# EAGLE design untitled (EAGLE 9.3.2)
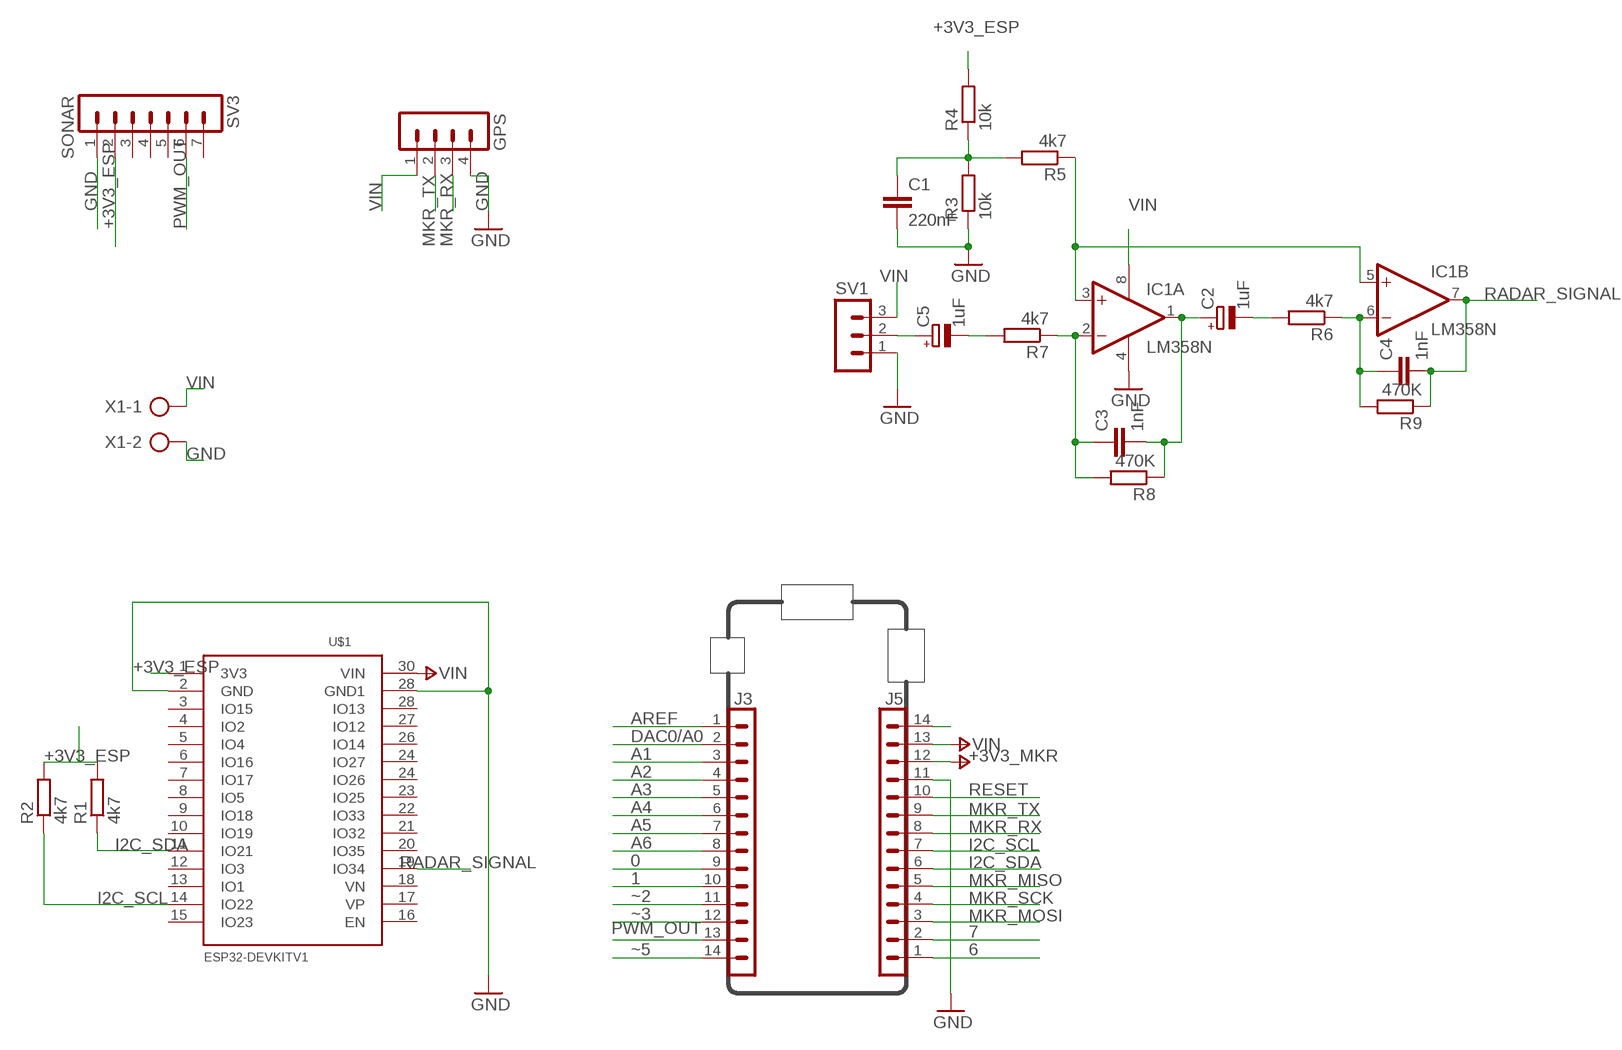
[diagram p0: schematic, sheet 1]

## Parts
C1  220nF  C-EU025-025X050  [C025-025X050]
C2  1uF  CPOL-EUE2-4  [E2-4]
C3  1nF  C-EU025-025X050  [C025-025X050]
C4  1nF  C-EU025-025X050  [C025-025X050]
C5  1uF  CPOL-EUE2-4  [E2-4]
GPS  MA04-1  [MA04-1]
IC1  LM358N  [DIL08]
J3  -  PINHD-1X14-SM-MALE/FEMALETH-SMD  [1X14_SMD_TH]
J5  -  PINHD-1X14-SM-MALE/FEMALETH-SMD  [1X14_SMD_TH]
R1  4k7  R-EU_0207/10  [0207/10]
R2  4k7  R-EU_0207/10  [0207/10]
R3  10k  R-EU_0207/10  [0207/10]
R4  10k  R-EU_0207/10  [0207/10]
R5  4k7  R-EU_0207/10  [0207/10]
R6  4k7  R-EU_0207/10  [0207/10]
R7  4k7  R-EU_0207/10  [0207/10]
R8  470K  R-EU_0207/2V  [0207/2V]
R9  470K  R-EU_0207/2V  [0207/2V]
SV1  MA03-1  [MA03-1]
SV3  SONAR  MA07-1  [MA07-1]
U$1  ESP32DEVKITV1  [ESP32-DEVKITV1]
X1  AK500/2-H  [AK500/2-H]

## Nets
+3V3_ESP: R1.2 R2.2 R4.2 SV3.2 U$1.1(3V3)
+3V3_MKR: J5.12 ; supply symbol labelled +3V3
GND: C1.2 GPS.4 IC1.4(P:V-) J5.11 R3.1 SV1.1 SV3.1 U$1.2(GND) U$1.28(GND1) X1.2
I2C_SCL: J5.7 R2.1 U$1.14(IO22)
I2C_SDA: J5.6 R1.1 U$1.11(IO21)
MKR_MISO: J5.5
MKR_MOSI: J5.3
MKR_RX: GPS.3 J5.8
MKR_SCK: J5.4
MKR_TX: GPS.2 J5.9
N$1: C1.1 R3.2 R4.1 R5.2
N$2: J5.14
N$4: C2.- R6.2
N$5: IC1.3(A:+IN) IC1.5(B:+IN) R5.1
N$6: C4.1 IC1.6(B:-IN) R6.1 R9.2
N$7: C5.- R7.2
N$8: C5.+ SV1.2
N$9: C3.1 IC1.2(A:-IN) R7.1 R8.2
N$10: C2.+ C3.2 IC1.1(A:OUT) R8.1
PA02_AIN0: J3.2
PA03_VREFA: J3.1
PA04_AIN4: J3.5
PA05_AIN5: J3.6
PA06_AIN6: J3.7
PA07_AIN7: J3.8
PA10_TCC0-W2: J3.11
PA11_TCC0-W3: J3.12
PA20_TCC0-W6: J5.1
PA21_TCC0-W7: J5.2
PA22_TC4-W0: J3.9
PA23_TC4-W1: J3.10
PB02_AIN10: J3.3
PB03_AIN11: J3.4
PB11_TCC0-W5: J3.14
PWM_OUT: J3.13 SV3.6
RADAR_SIGNAL: C4.2 IC1.7(B:OUT) R9.1 U$1.19(IO34)
RESET: J5.10
VIN: GPS.1 IC1.8(P:V+) J5.13 SV1.3 U$1.30(VIN) X1.1
Unconnected: SV3.3 SV3.4 SV3.5 SV3.7 U$1.3(IO15) U$1.4(IO2) U$1.5(IO4) U$1.6(IO16) U$1.7(IO17) U$1.8(IO5) U$1.9(IO18) U$1.10(IO19) U$1.12(IO3) U$1.13(IO1) U$1.15(IO23) U$1.16(EN) U$1.17(VP) U$1.18(VN) U$1.20(IO35) U$1.21(IO32) U$1.22(IO33) U$1.23(IO25) U$1.24(IO26) U$1.24(IO27) U$1.26(IO14) U$1.27(IO12) U$1.28(IO13)

## Notes on the sheet
- AREF
- DAC0/A0
- A1
- A2
- A3 | RESET
- A4
- A5
- A6
- 0
- 1
- ~2
- ~3
- 7
- ~5 | 6

## Library data of the parts
C1 C3 C4 = rcl:C-EU: CAPACITOR, European symbol; SPICEPREFIX: C
C2 C5 = rcl:CPOL-EU: POLARIZED CAPACITOR, European symbol; SPICEPREFIX: C
GPS = con-lstb:MA04-1: PIN HEADER; OC_FARNELL: unknown; OC_NEWARK: unknown
IC1 = linear:LM358: OP AMP also LM158; LM258; LM2904 Source: http://cache.national.com/ds/LM/LM158.pdf
J3 J5 = Arduino-connectors:PINHD-1X14-SM: PIN HEADER; DATASHEET: -; DISTRIBUTOR-LINK: -; DISTRIBUTOR-PN: -; MANUFACTURER: ELDECO; MANUFACTURER-PN: FH254114DF08500T
R1-R9 = rcl:R-EU_: RESISTOR, European symbol; SPICEPREFIX: R
SV1 = con-lstb:MA03-1: PIN HEADER; OC_FARNELL: unknown; OC_NEWARK: unknown
SV3 = con-lstb:MA07-1: PIN HEADER; OC_FARNELL: unknown; OC_NEWARK: unknown
U$1 = ESP32-DEVKITV1:ESP32DEVKITV1
X1 = con-ptr500:AK500/2-H: CONNECTOR Aug. 2004 / PTR Meßtechnik: Die Bezeichnung der Serie AK505 wurde geändert. Es handelt sich hierbei um AK500 in horizontaler Ausführung.; OC_FARNELL: unknown; OC_NEWARK: unknown

## Net classes
0 default: width 0.19 mm, drill 0.19 mm

## Board
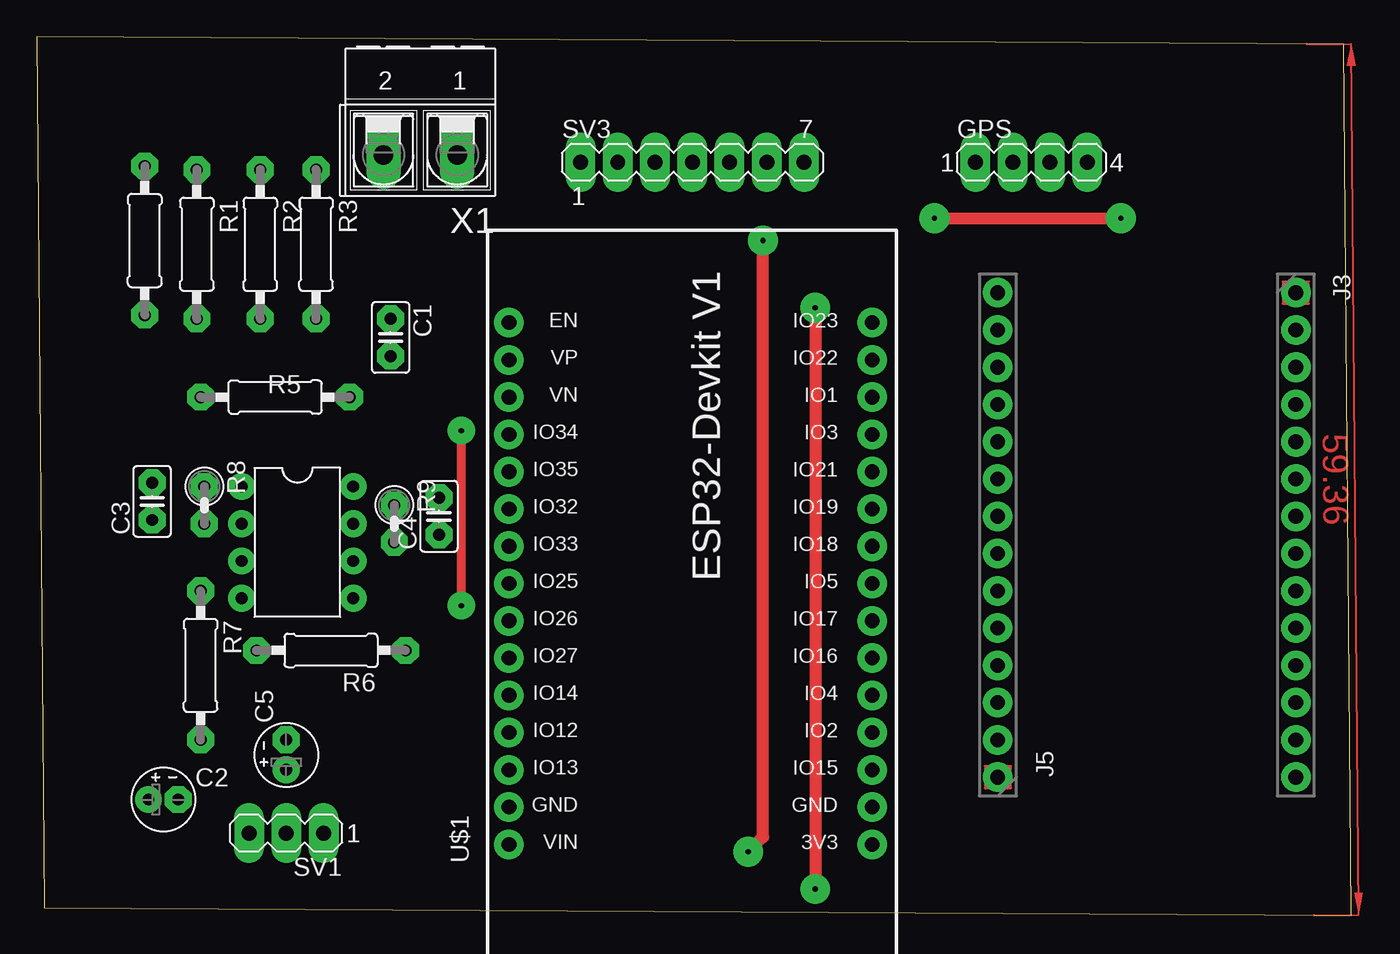
[diagram p1: board, top side]
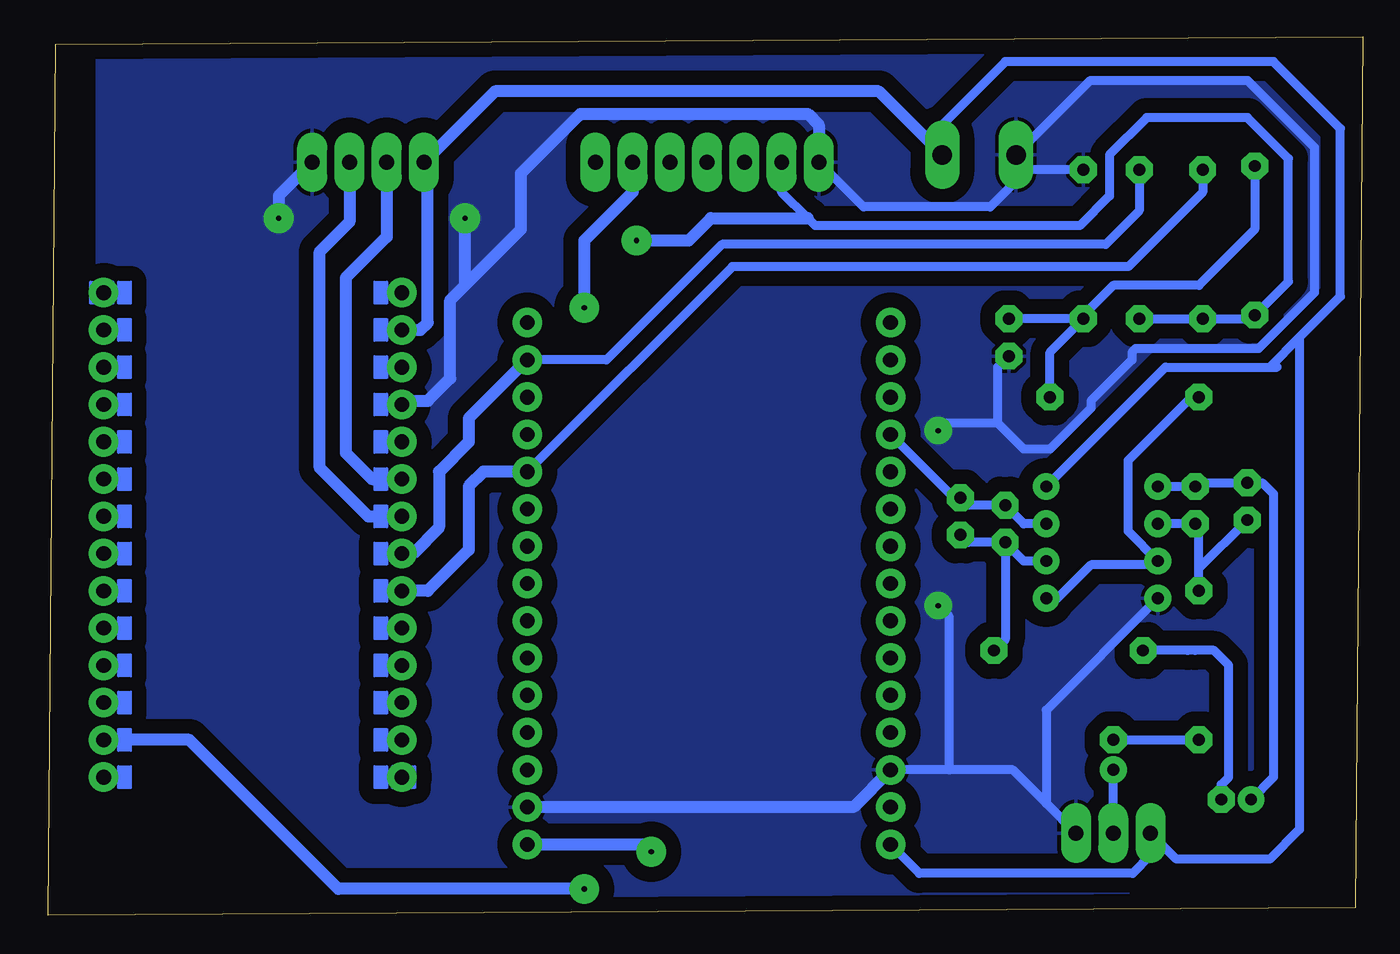
[diagram p2: board, bottom side, seen from below]

Size 89.64 x 59.87 mm. Coordinates in mm from the lower left corner, seen from the top.
Outline: 0.51,0.51 89.64,0 89.13,59.36 0,59.87 0.51,0.51
Copper layers (1*16): Top 0.035mm / dielectric 1.5mm / Bottom 0.035mm
Design rules "default *": minimum track width 15mil, minimum drill 0.35mm, track to track 40mil, track to pad 40mil, pad to pad 40mil, via to via 40mil, smd to smd 6mil, copper to edge 40mil, drill to drill 6mil, minimum pad ring 20mil, minimum via ring 30mil, stop-mask expansion 4mil, vias tented up to drill 0mil, thermal gap 10mil

### Footprints (pad centres in the part's own frame; a part is rotated, then mirrored left to right if it is on the bottom)
C025-025X050 = drill 0.813 octagon: 1 -1.27,0; 2 1.27,0
E2-4 = drill 0.813 pad 1.27: + -1.016,0 | drill 0.813 pad 1.27 octagon: - 1.016,0
MA04-1 = drill 1.016 long: 1 -3.81,0; 2 -1.27,0; 3 1.27,0; 4 3.81,0
DIL08 = drill 0.813 pad 1.27: 1 -3.81,-3.81; 2 -1.27,-3.81; 3 1.27,-3.81; 4 3.81,-3.81; 5 3.81,3.81; 6 1.27,3.81; 7 -1.27,3.81; 8 -3.81,3.81
1X14_SMD_TH = drill 1: 1 0,0; 2 2.54,0; 3 5.08,0; 4 7.62,0; 5 10.16,0; 6 12.7,0; 7 15.24,0; 8 17.78,0; 9 20.32,0; 10 22.86,0; 11 25.4,0; 12 27.94,0; 13 30.48,0; 14 33.02,0
0207/10 = drill 0.813 octagon: 1 -5.08,0; 2 5.08,0
0207/2V = drill 0.813 octagon: 1 -1.27,0; 2 1.27,0
MA03-1 = drill 1.016 long: 1 -2.54,0; 2 0,0; 3 2.54,0
MA07-1 = drill 1.016 long: 1 -7.62,0; 2 -5.08,0; 3 -2.54,0; 4 0,0; 5 2.54,0; 6 5.08,0; 7 7.62,0
ESP32-DEVKITV1 = drill 1 pad 1.93: 1 -22.87,-13.54; 2 -20.33,-13.54; 3 -17.79,-13.54; 4 -15.25,-13.54; 5 -12.71,-13.54; 6 -10.17,-13.54; 7 -7.63,-13.54; 8 -5.09,-13.54; 9 -2.55,-13.54; 10 -0.01,-13.54; 11 2.53,-13.54; 12 5.07,-13.54; 13 7.61,-13.54; 14 10.15,-13.54; 15 12.69,-13.54; 16 12.69,11.23; 17 10.15,11.23; 18 7.61,11.23; 19 5.07,11.23; 20 2.53,11.23; 21 -0.01,11.23; 22 -2.55,11.23; 23 -5.09,11.23; 24 -7.63,11.23; 25 -10.17,11.23; 26 -12.71,11.23; 27 -15.25,11.23; 28 -17.79,11.23; 29 -20.33,11.23; 30 -22.87,11.23
AK500/2-H = drill 1.321 long: 1 -2.515,0; 2 2.515,0

### Placement (x,y rotation side)
C1  24.13,39.37 270 top
C2  8.64,7.87 0 top
C3  7.87,28.19 90 top
C4  27.43,27.18 90 top
C5  17.02,10.92 90 top
GPS  67.82,51.31 0 top
IC1  17.78,25.4 270 top
J3  85.85,42.42 270 top
J5  65.53,9.4 90 top
R1  10.92,45.72 270 top
R2  15.24,45.72 270 top
R3  19.05,45.72 270 top
R4  7.37,45.97 270 top
R5  16.26,35.31 0 top
R6  20.07,18.03 180 top
R7  11.18,17.02 270 top
R8  11.43,27.94 270 top
R9  24.38,26.67 270 top
SV1  17.02,5.59 180 top
SV3  44.7,51.31 0 top
U$1  43.43,27.69 90 top
X1  26.16,51.82 180 top

### Tracks (layer width: path | path; a pad name or v marks a point on that pad's centre or on a via)
+3V3_ESP  (via drill 0.35 pad 2.03)
  Top 0.813: v48.51,4.32 49.53,5.33 v49.53,45.97 49.53,46.23
  Bottom 0.61: R1.2 R2.2 7.62,40.64 R4.2 5.08,43.18 5.08,51.56 7.87,54.36 14.73,54.36 17.27,51.82 17.27,49.02 19.3,46.99 37.34,46.99 37.85,47.5 39.62,49.28 SV3.2
  Bottom 0.813: 37.85,47.5 44.45,47.5 45.97,45.97 v49.53,45.97 | U$1.1 49.01,4.82 v48.51,4.32
GND  (via drill 0.35, 0.35 pad 2.03)
  Top 0.61: v28.96,21.08 v28.96,33.02
  Top 0.813: v61.21,47.5 v73.91,47.5
  Bottom 0.61: SV1.1 21.59,7.62 | 21.59,7.62 23.87,9.9 28.19,9.9 | 28.19,9.9 U$1.28 | IC1.4 21.59,13.97 21.59,7.62 | R3.1 22.63,50.8 X1.2 | X1.2 18.57,56.9 7.87,56.9 3.3,52.32 3.3,42.42 7.11,38.61 15.49,38.61 15.75,38.35 15.75,37.85 18.54,35.05 18.54,34.54 21.34,31.75 23.11,31.75 24.89,33.53 | C1.2 24.89,37.34 24.89,33.53 | 28.19,9.9 28.19,20.32 v28.96,21.08 | 24.89,33.53 28.45,33.53 v28.96,33.02 | X1.2 23.65,50.06 23.62,50.04 25.4,48.26 34.04,48.26 SV3.1
  Bottom 0.813: U$1.28 34.74,7.36 U$1.2 | J5.11 65.28,35.05 63.75,35.05 62.23,36.58 62.23,41.91 61.21,42.93 | SV3.1 37.08,53.85 37.85,54.61 53.34,54.61 57.4,50.55 57.4,46.74 61.21,42.93 | 61.21,42.93 v61.21,47.5 | GPS.4 73.91,49.02 v73.91,47.5
  pour Bottom: 0.51,0.76 0.25,1.02 0.25,59.94 85.85,59.94 86.36,59.44 86.36,0.25
I2C_SCL
  Bottom 0.61: R2.1 15.24,48.01 17.53,45.72 43.69,45.72 51.57,37.84 U$1.14
  Bottom 0.813: U$1.14 60.96,33.85 60.96,32.26 62.99,30.23 62.99,26.42 64.77,24.64 J5.7
I2C_SDA
  Bottom 0.61: R1.1 10.92,49.28 16,44.2 42.99,44.2 U$1.11
  Bottom 0.813: U$1.11 59.95,30.22 60.96,29.21 60.96,24.89 63.75,22.1 J5.6
MKR_RX
  Bottom 0.813: GPS.3 69.09,47.24 71.12,45.21 71.12,30.48 67.82,27.18 J5.8
MKR_TX
  Bottom 0.813: GPS.2 66.55,46.23 69.34,43.43 69.34,31.5 67.56,29.72 J5.9
N$1
  Bottom 0.61: R5.2 21.34,38.35 R3.2 19.3,40.64 | 19.3,40.64 C1.1 | R4.1 7.37,46.74 11.18,42.93 17.02,42.93 19.3,40.64
N$4
  Bottom 0.61: R6.2 11.94,18.03 11.43,18.03 10.16,18.03 9.14,17.02 9.14,9.4 9.65,8.89 C2.-
N$5
  Bottom 0.61: R5.1 11.68,35.31 16,30.99 16,26.16 IC1.3 14.22,23.88 18.54,23.88 20.83,21.59 IC1.5
N$6
  Bottom 0.61: R9.2 23.11,24.13 IC1.6 21.34,24.38 | R9.2 24.38,18.8 R6.1 | R9.2 26.92,25.4 C4.1
N$7
  Bottom 0.61: C5.- R7.2
N$8
  Bottom 0.61: SV1.2 C5.+
N$9
  Bottom 0.61: R7.1 11.18,23.62 | 11.18,23.62 11.18,26.42 R8.2 IC1.2 | 11.18,23.62 C3.1
N$10
  Bottom 0.61: IC1.1 R8.1 11.18,29.46 C3.2 6.86,29.46 6.1,28.7 6.1,9.4 C2.+
PWM_OUT  (via drill 0.35 pad 2.03)
  Top 0.813: v53.09,41.4 v53.09,1.78
  Bottom 0.813: SV3.6 49.78,49.28 53.09,45.97 v53.09,41.4 | v53.09,1.78 69.85,1.78 80.01,11.94 J3.13
RADAR_SIGNAL
  Bottom 0.61: IC1.7 23.11,26.67 R9.1 27.39,27.94 27.9,28.45 | 27.9,28.45 32.11,32.66 | 32.11,32.66 U$1.19 | 31.6,32.66 32.11,32.66 | C4.2 27.9,28.45
VIN
  Bottom 0.61: U$1.30 30.23,2.84 15.7,2.84 14.48,4.06 SV1.3 12.7,3.81 6.35,3.81 4.32,5.84 4.32,39.37 | IC1.8 13.46,37.34 6.35,37.34 | 6.35,37.34 5.84,37.34 | 6.35,37.34 4.32,39.37 | 4.32,39.37 1.52,42.16 1.52,53.59 6.1,58.17 24.38,58.17 28.68,53.87 X1.1
  Bottom 0.813: X1.1 32.99,56.13 59.18,56.13 GPS.1 63.75,51.05 63.75,40.39 64.26,39.88 J5.13
(copper drawn outside any net)
  shapes: Top area x1